# Altium schematic sheet tube-control.SchDoc
size B portrait; SheetNumber: 7; SheetTotal: 9
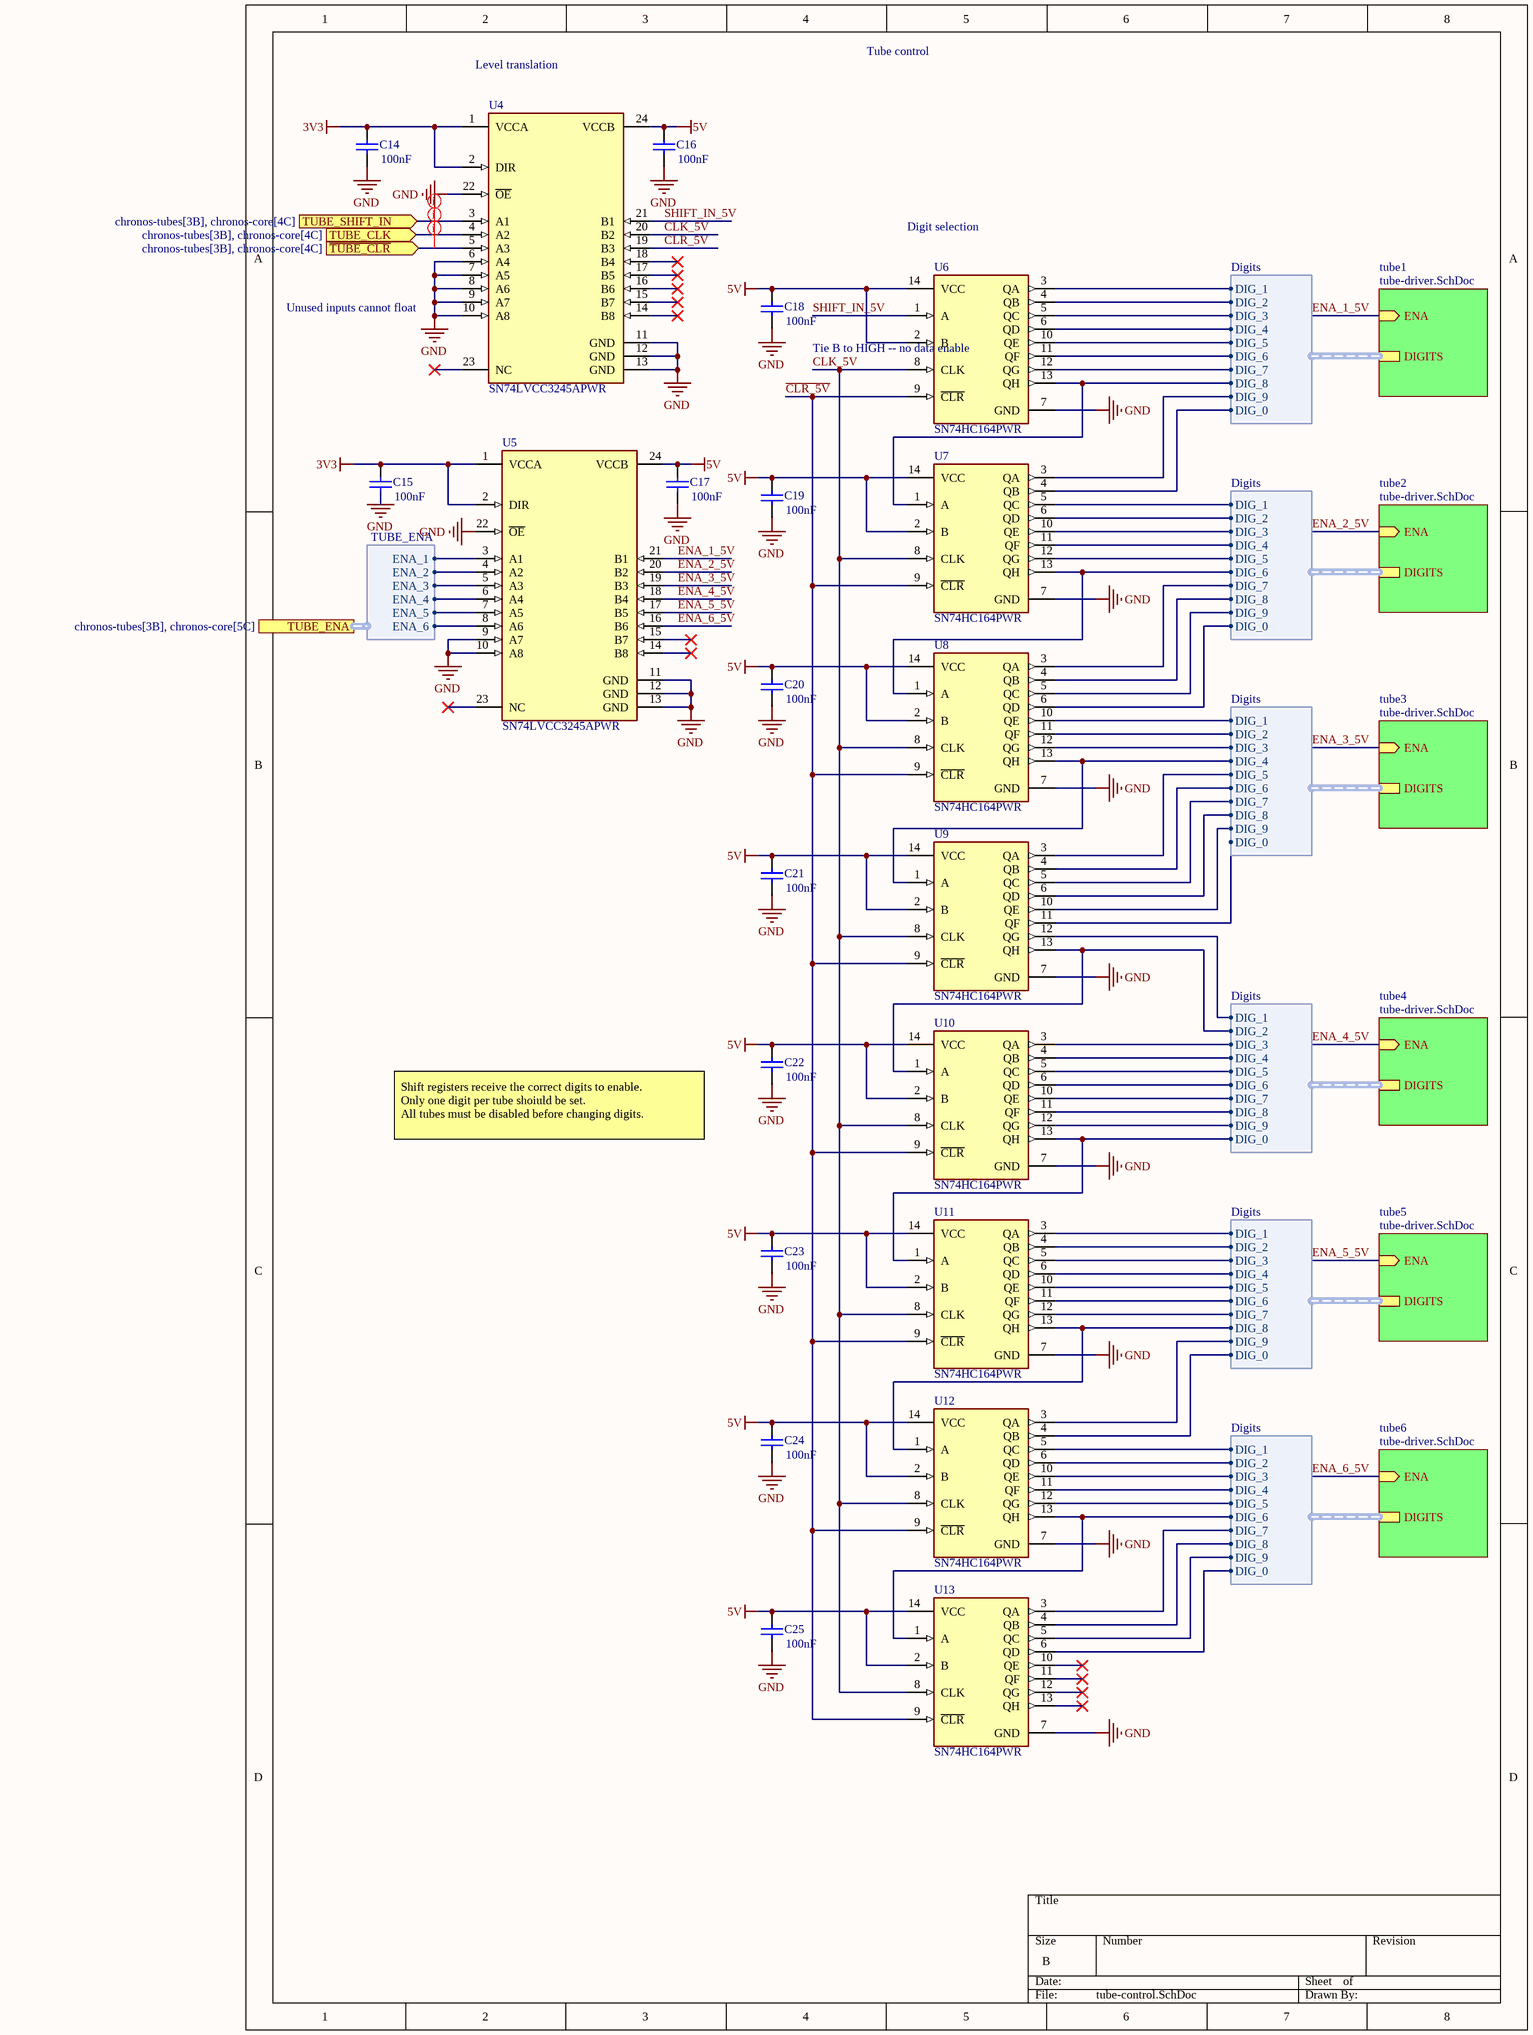
[diagram p0: tube-control.SchDoc]

## Parts
C14  Capacitance: 100nF  [CAPC1050X55X23ML05T13]  (hidden comment: CL05B104KO5NNNC)
C15  Capacitance: 100nF  [CAPC1050X55X23ML05T13]  (hidden comment: CL05B104KO5NNNC)
C16  Capacitance: 100nF  [CAPC1050X55X23ML05T13]  (hidden comment: CL05B104KO5NNNC)
C17  Capacitance: 100nF  [CAPC1050X55X23ML05T13]  (hidden comment: CL05B104KO5NNNC)
C18  Capacitance: 100nF  [CAPC1050X55X23ML05T13]  (hidden comment: CL05B104KO5NNNC)
C19  Capacitance: 100nF  [CAPC1050X55X23ML05T13]  (hidden comment: CL05B104KO5NNNC)
C20  Capacitance: 100nF  [CAPC1050X55X23ML05T13]  (hidden comment: CL05B104KO5NNNC)
C21  Capacitance: 100nF  [CAPC1050X55X23ML05T13]  (hidden comment: CL05B104KO5NNNC)
C22  Capacitance: 100nF  [CAPC1050X55X23ML05T13]  (hidden comment: CL05B104KO5NNNC)
C23  Capacitance: 100nF  [CAPC1050X55X23ML05T13]  (hidden comment: CL05B104KO5NNNC)
C24  Capacitance: 100nF  [CAPC1050X55X23ML05T13]  (hidden comment: CL05B104KO5NNNC)
C25  Capacitance: 100nF  [CAPC1050X55X23ML05T13]  (hidden comment: CL05B104KO5NNNC)
U4  SN74LVCC3245APWR  [FP-PW0024A-MFG]
U5  SN74LVCC3245APWR  [FP-PW0024A-MFG]
U6  SN74HC164PWR  [FP-PW0014A-MFG]
U7  SN74HC164PWR  [FP-PW0014A-MFG]
U8  SN74HC164PWR  [FP-PW0014A-MFG]
U9  SN74HC164PWR  [FP-PW0014A-MFG]
U10  SN74HC164PWR  [FP-PW0014A-MFG]
U11  SN74HC164PWR  [FP-PW0014A-MFG]
U12  SN74HC164PWR  [FP-PW0014A-MFG]
U13  SN74HC164PWR  [FP-PW0014A-MFG]

## Sub-sheets
tube1 = tube-driver.SchDoc: ENA (in), DIGITS (harness Digits)
tube2 = tube-driver.SchDoc: ENA (in), DIGITS (harness Digits)
tube3 = tube-driver.SchDoc: ENA (in), DIGITS (harness Digits)
tube4 = tube-driver.SchDoc: ENA (in), DIGITS (harness Digits)
tube5 = tube-driver.SchDoc: ENA (in), DIGITS (harness Digits)
tube6 = tube-driver.SchDoc: ENA (in), DIGITS (harness Digits)

## Ports
TUBE_CLK (in, see chronos-tubes[3B], chronos-core[4C]), TUBE_ENA (harness TUBE_ENA, see chronos-tubes[3B], chronos-core[5C]), TUBE_SHIFT_IN (in, see chronos-tubes[3B], chronos-core[4C]), ~{TUBE_CLR} (in, see chronos-tubes[3B], chronos-core[4C])

## Harnesses
Digits: DIG_1, DIG_2, DIG_3, DIG_4, DIG_5, DIG_6, DIG_7, DIG_8, DIG_9, DIG_0
TUBE_ENA: ENA_1, ENA_2, ENA_3, ENA_4, ENA_5, ENA_6

## Nets
3V3: C14.2 C15.2 U4.1(VCCA) U4.2(DIR) U5.1(VCCA) U5.2(DIR)
5V: C16.2 C17.2 C18.2 C19.2 C20.2 C21.2 C22.2 C23.2 C24.2 C25.2 U4.24(VCCB) U5.24(VCCB) U6.2(B) U6.14(VCC) U7.2(B) U7.14(VCC) U8.2(B) U8.14(VCC) U9.2(B) U9.14(VCC) U10.2(B) U10.14(VCC) U11.2(B) U11.14(VCC) U12.2(B) U12.14(VCC) U13.2(B) U13.14(VCC)
GND: C14.1 C15.1 C16.1 C17.1 C18.1 C19.1 C20.1 C21.1 C22.1 C23.1 C24.1 C25.1 U4.6(A4) U4.7(A5) U4.8(A6) U4.9(A7) U4.10(A8) U4.11(GND) U4.12(GND) U4.13(GND) U4.22(~{OE}) U5.9(A7) U5.10(A8) U5.11(GND) U5.12(GND) U5.13(GND) U5.22(~{OE}) U6.7(GND) U7.7(GND) U8.7(GND) U9.7(GND) U10.7(GND) U11.7(GND) U12.7(GND) U13.7(GND)
~{CLR_5V}: U4.19(B3) U6.9(~{CLR}) U7.9(~{CLR}) U8.9(~{CLR}) U9.9(~{CLR}) U10.9(~{CLR}) U11.9(~{CLR}) U12.9(~{CLR}) U13.9(~{CLR})
~{TUBE_CLR}: U4.5(A3) ; port ~{TUBE_CLR}
CLK_5V: U4.20(B2) U6.8(CLK) U7.8(CLK) U8.8(CLK) U9.8(CLK) U10.8(CLK) U11.8(CLK) U12.8(CLK) U13.8(CLK)
ENA_1_5V: U5.21(B1) ; sheet tube1/ENA
ENA_2_5V: U5.20(B2) ; sheet tube2/ENA
ENA_3_5V: U5.19(B3) ; sheet tube3/ENA
ENA_4_5V: U5.18(B4) ; sheet tube4/ENA
ENA_5_5V: U5.17(B5) ; sheet tube5/ENA
ENA_6_5V: U5.16(B6) ; sheet tube6/ENA
SHIFT_IN_5V: U4.21(B1) U6.1(A)
TUBE_CLK: U4.4(A2) ; port TUBE_CLK
TUBE_SHIFT_IN: U4.3(A1) ; port TUBE_SHIFT_IN
NetU5_3: U5.3(A1) ; port TUBE_ENA.ENA_1
NetU5_4: U5.4(A2) ; port TUBE_ENA.ENA_2
NetU5_5: U5.5(A3) ; port TUBE_ENA.ENA_3
NetU5_6: U5.6(A4) ; port TUBE_ENA.ENA_4
NetU5_7: U5.7(A5) ; port TUBE_ENA.ENA_5
NetU5_8: U5.8(A6) ; port TUBE_ENA.ENA_6
NetU6_3: U6.3(QA) ; sheet tube1/DIGITS.DIG_1
NetU6_4: U6.4(QB) ; sheet tube1/DIGITS.DIG_2
NetU6_5: U6.5(QC) ; sheet tube1/DIGITS.DIG_3
NetU6_6: U6.6(QD) ; sheet tube1/DIGITS.DIG_4
NetU6_10: U6.10(QE) ; sheet tube1/DIGITS.DIG_5
NetU6_11: U6.11(QF) ; sheet tube1/DIGITS.DIG_6
NetU6_12: U6.12(QG) ; sheet tube1/DIGITS.DIG_7
NetU6_13: U6.13(QH) U7.1(A) ; sheet tube1/DIGITS.DIG_8
NetU7_3: U7.3(QA) ; sheet tube1/DIGITS.DIG_9
NetU7_4: U7.4(QB) ; sheet tube1/DIGITS.DIG_0
NetU7_5: U7.5(QC) ; sheet tube2/DIGITS.DIG_1
NetU7_6: U7.6(QD) ; sheet tube2/DIGITS.DIG_2
NetU7_10: U7.10(QE) ; sheet tube2/DIGITS.DIG_3
NetU7_11: U7.11(QF) ; sheet tube2/DIGITS.DIG_4
NetU7_12: U7.12(QG) ; sheet tube2/DIGITS.DIG_5
NetU7_13: U7.13(QH) U8.1(A) ; sheet tube2/DIGITS.DIG_6
NetU8_3: U8.3(QA) ; sheet tube2/DIGITS.DIG_7
NetU8_4: U8.4(QB) ; sheet tube2/DIGITS.DIG_8
NetU8_5: U8.5(QC) ; sheet tube2/DIGITS.DIG_9
NetU8_6: U8.6(QD) ; sheet tube2/DIGITS.DIG_0
NetU8_10: U8.10(QE) ; sheet tube3/DIGITS.DIG_1
NetU8_11: U8.11(QF) ; sheet tube3/DIGITS.DIG_2
NetU8_12: U8.12(QG) ; sheet tube3/DIGITS.DIG_3
NetU8_13: U8.13(QH) U9.1(A) ; sheet tube3/DIGITS.DIG_4
NetU9_3: U9.3(QA) ; sheet tube3/DIGITS.DIG_5
NetU9_4: U9.4(QB) ; sheet tube3/DIGITS.DIG_6
NetU9_5: U9.5(QC) ; sheet tube3/DIGITS.DIG_7
NetU9_6: U9.6(QD) ; sheet tube3/DIGITS.DIG_8
NetU9_10: U9.10(QE) ; sheet tube3/DIGITS.DIG_9
NetU9_11: U9.11(QF) ; sheet tube3/DIGITS.DIG_0
NetU9_12: U9.12(QG) ; sheet tube4/DIGITS.DIG_1
NetU9_13: U9.13(QH) U10.1(A) ; sheet tube4/DIGITS.DIG_2
NetU10_3: U10.3(QA) ; sheet tube4/DIGITS.DIG_3
NetU10_4: U10.4(QB) ; sheet tube4/DIGITS.DIG_4
NetU10_5: U10.5(QC) ; sheet tube4/DIGITS.DIG_5
NetU10_6: U10.6(QD) ; sheet tube4/DIGITS.DIG_6
NetU10_10: U10.10(QE) ; sheet tube4/DIGITS.DIG_7
NetU10_11: U10.11(QF) ; sheet tube4/DIGITS.DIG_8
NetU10_12: U10.12(QG) ; sheet tube4/DIGITS.DIG_9
NetU10_13: U10.13(QH) U11.1(A) ; sheet tube4/DIGITS.DIG_0
NetU11_3: U11.3(QA) ; sheet tube5/DIGITS.DIG_1
NetU11_4: U11.4(QB) ; sheet tube5/DIGITS.DIG_2
NetU11_5: U11.5(QC) ; sheet tube5/DIGITS.DIG_3
NetU11_6: U11.6(QD) ; sheet tube5/DIGITS.DIG_4
NetU11_10: U11.10(QE) ; sheet tube5/DIGITS.DIG_5
NetU11_11: U11.11(QF) ; sheet tube5/DIGITS.DIG_6
NetU11_12: U11.12(QG) ; sheet tube5/DIGITS.DIG_7
NetU11_13: U11.13(QH) U12.1(A) ; sheet tube5/DIGITS.DIG_8
NetU12_3: U12.3(QA) ; sheet tube5/DIGITS.DIG_9
NetU12_4: U12.4(QB) ; sheet tube5/DIGITS.DIG_0
NetU12_5: U12.5(QC) ; sheet tube6/DIGITS.DIG_1
NetU12_6: U12.6(QD) ; sheet tube6/DIGITS.DIG_2
NetU12_10: U12.10(QE) ; sheet tube6/DIGITS.DIG_3
NetU12_11: U12.11(QF) ; sheet tube6/DIGITS.DIG_4
NetU12_12: U12.12(QG) ; sheet tube6/DIGITS.DIG_5
NetU12_13: U12.13(QH) U13.1(A) ; sheet tube6/DIGITS.DIG_6
NetU13_3: U13.3(QA) ; sheet tube6/DIGITS.DIG_7
NetU13_4: U13.4(QB) ; sheet tube6/DIGITS.DIG_8
NetU13_5: U13.5(QC) ; sheet tube6/DIGITS.DIG_9
NetU13_6: U13.6(QD) ; sheet tube6/DIGITS.DIG_0

Not connected (* = marked no-connect by the designer): U4 14(B8)* 15(B7)* 16(B6)* 17(B5)* 18(B4)* 23(NC)*; U5 14(B8)* 15(B7)* 23(NC)*; U13 10(QE)* 11(QF)* 12(QG)* 13(QH)*

## Layout directives
net class TUBE_CONTROL: TUBE_CLK, TUBE_SHIFT_IN, ~{TUBE_CLR}

## Notes on the sheet
- Level translation
- Tube control
- Digit selection
- (near U4) Unused inputs cannot float
- (near U6) Tie B to HIGH -- no data enable
- Shift registers receive the correct digits to enable.
  Only one digit per tube shoiuld be set.
  All tubes must be disabled before changing digits.

## Library data of the parts
C14-C25 = CMP-2000-05439-1: Chip Capacitor, 100 nF, +/- 10%, 16 V, -55 to 125 degC, 0402 (1005 Metric), RoHS, Tape and Reel; Manufacturer: Samsung Electro-Mechanics; Dielectric: X7R; Rated Voltage: 16V; Case Size/Dimension: 0402; Tolerance (%): ±10%; Manufacturer URL: http://www.samsungsem.com/global/index.jsp; Datasheet URL: https://datasheet.ciiva.com/29198/458718-da-01-en-vs-kondensator-0402-29198423.pdf; Datasheet Version: Nov-10
U4 U5 = CMP-04899-000013-1: IC TRNSLTR BIDIRECTIONAL 24TSSOP; Manufacturer: Texas Instruments; Number Of Inputs: 1; V A Min: 2.3V; V A Max: 3.6V; Max Junction Temp: +150°C; V B Max: 5.5V; Number Of Circuits: 8; Standoff Height: 0.05mm; Nominal Supply Current: 5-8uA; Logic Function Desc: Non-Inverting; V B Min: 3V; Device Class L3: Voltage Level Shifters; ComponentLink2Description: Datasheet; Manufacturer Part Number: SN74LVCC3245APWR; Device Class L2: Logic ICs; Digikey Description: IC TRNSLTR BIDIRECTIONAL 24TSSOP; Min Supply Voltage: 2.3V; Temperature Range High: +85°C; Automotive: No; Mouser Description: Octal Bus Transceiver With Adjustable Output Voltage and 3-State Outputs 24-TSSOP -40 to 85; RoHS: TRUE; Package: PW0024A; Number Of Outputs: 1; Lead Free: Yes; Temperature Range Low: -40°C; Ambient Temperature Range High: +85°C; Ambient Temperature Range Low: -40°C; Max Supply Voltage: 5.5V; Category: IC; Octopart: https://octopart.com/sn74lvcc3245apwr-texas+instruments-517488; Device Class L1: Integrated Circuits (ICs); Height: 1.2mm; ComponentLink2URL: http://www.ti.com/lit/ds/symlink/sn74lvcc3245a.pdf; Temperature: -40°C to +85°C
U6-U13 = CMP-0780-00172-4: IC SHFT REG SERIAL 8BIT 14-TSSOP; Manufacturer: Texas Instruments; Min Supply Voltage: 2V; Standoff Height: 0.05mm; Number Of Circuits: 1; Max Supply Voltage: 6V; Frequency: 36MHz; Nominal Supply Current: 160uA; Number Of Outputs: 8; Propagation Delay: 20ns; Number Of Inputs: 2; Logic Function Desc: Shift Register; Temperature: -40°C to +125°C; Package: PW0014A; Automotive: No; Device Class L3: Shift Registers; Ambient Temperature Range Low: -40°C; Device Class L1: Integrated Circuits (ICs); ComponentLink2Description: Datasheet; Category: IC; Manufacturer Part Number: SN74HC164PWR; Device Class L2: Logic ICs; Mouser Description: Shift Register Single 8-Bit Serial to Parallel 14-Pin TSSOP T/R; ComponentLink2URL: http://www.ti.com/lit/ds/symlink/sn74hc164.pdf; Lead Free: Yes; Height: 1.2mm; Ambient Temperature Range High: +125°C; Octopart: https://octopart.com/sn74hc164pwr-texas+instruments-500613; RoHS: TRUE; Temperature Range High: +125°C; Digikey Description: IC SHFT REG SERIAL 8BIT 14-TSSOP; Temperature Range Low: -40°C